# Altium schematic sheet Experiment 4 0.0.0.SchDoc
size A4; Organization: Altium Limited; Address1: L3, 12a Rodborough Rd; Address2: Frenchs Forest; Address3: NSW; Address4: Australia 2086; DocumentNumber: 4; SheetNumber: 4; SheetTotal: 5
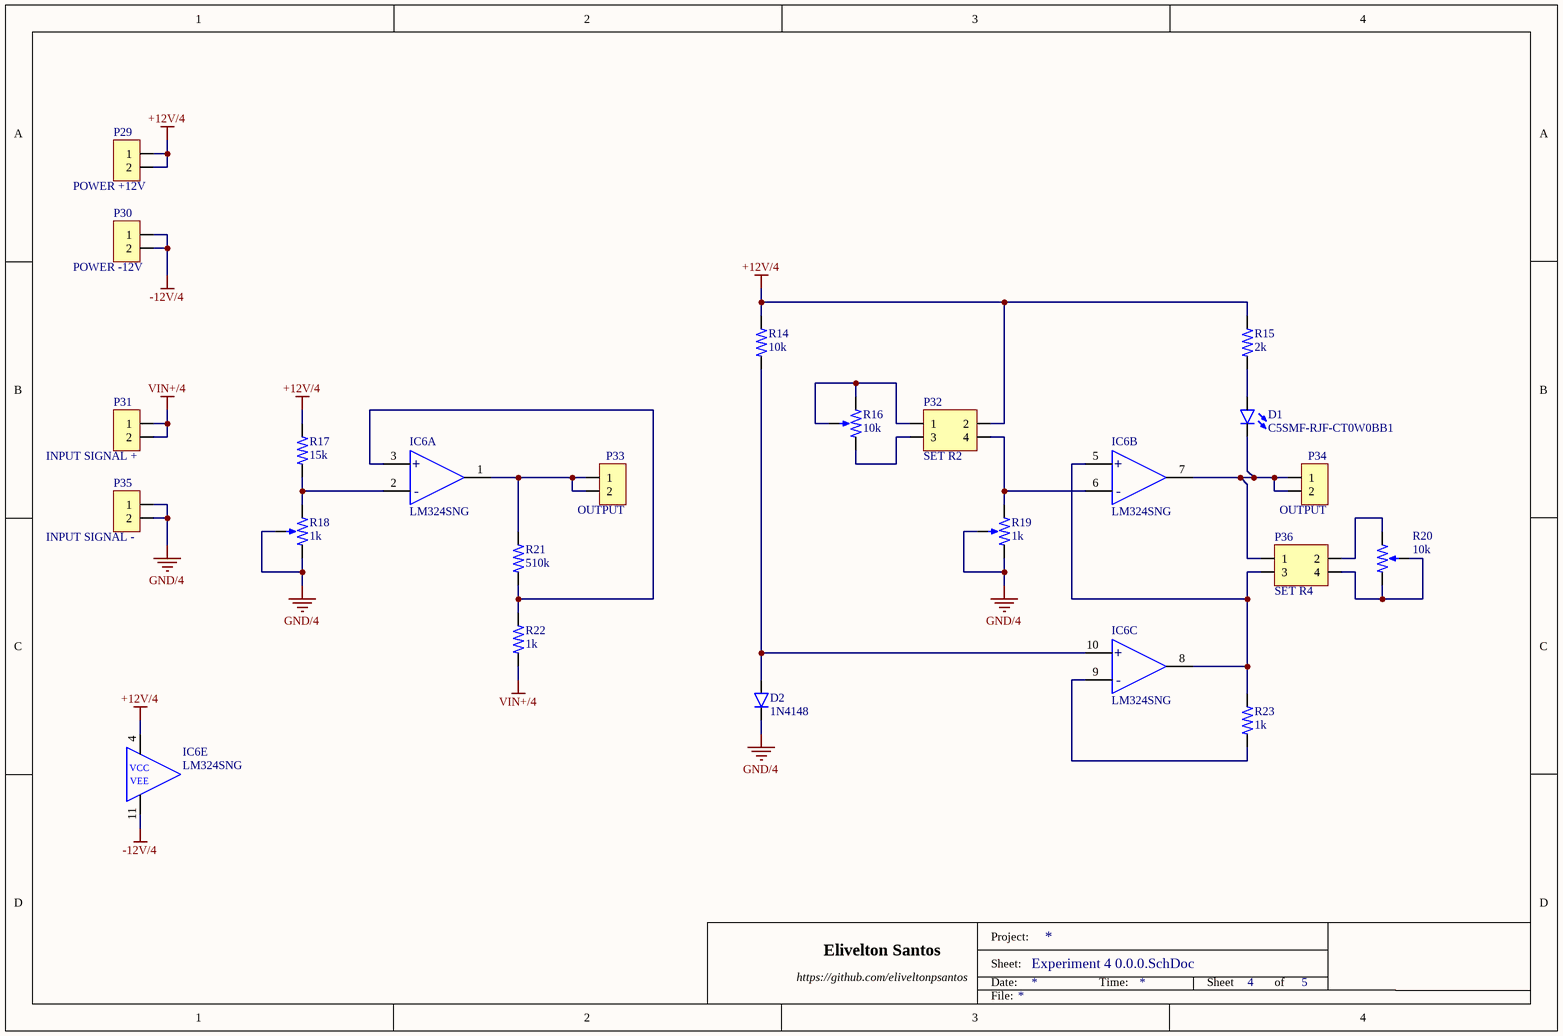
[diagram p0: Experiment 4 0.0.0.SchDoc]

## Parts
D1  C5SMF-RJF-CT0W0BB1  [LED-5MM]
D2  1N4148  [DO35-10]
IC6  LM324SNG  [DIP-14]  (parts A,B,C,E of 5)
P29  POWER +12V  [PINHD-1X02 ONCE]
P30  POWER -12V  [PINHD-1X02 ONCE]
P31  INPUT SIGNAL +  [PINHD-1X02 ONCE]
P32  SET R2  [PINHD-2X02]
P33  OUTPUT  [PINHD-1X02 ONCE]
P34  OUTPUT  [PINHD-1X02 ONCE]
P35  INPUT SIGNAL -  [PINHD-1X02 ONCE]
P36  SET R4  [PINHD-2X02]
R14  10k  [R Axial 0.25]
R15  2k  [R Axial 0.25]
R16  10k  [PV36W]
R17  15k  [R Axial 0.25]
R18  1k  [PV36W]
R19  1k  [PV36W]
R20  10k  [PV36W]
R21  510k  [R Axial 0.25]
R22  1k  [R Axial 0.25]
R23  1k  [R Axial 0.25]

## Nets
+12V/4: IC6.4(VCC) P29.1 P29.2 P32.2 R14.2 R15.2 R17.2
-12V/4: IC6.11(VEE) P30.1 P30.2
GND/4: D2.C(Cathode) P35.1 P35.2 R18.2 R18.3 R19.2 R19.3
VIN+/4: P31.1 P31.2 R22.1
NetD1_1: D1.1(Anode) R15.1
NetD1_2: D1.2(Cathode) IC6.7(OUTPUT_2) P34.1 P34.2 P36.1
NetD2_A: D2.A(Anode) IC6.10(INPUT_+_3) R14.1
NetIC6_1: IC6.1(OUTPUT_1) P33.1 P33.2 R21.2
NetIC6_2: IC6.2(INPUT_-_1) R17.1 R18.1
NetIC6_3: IC6.3(INPUT_+_1) R21.1 R22.2
NetIC6_5: IC6.5(INPUT_+_2) IC6.8(OUTPUT_3) P36.3 R23.2
NetIC6_6: IC6.6(INPUT_-_2) P32.4 R19.1
NetIC6_9: IC6.9(INPUT_-_3) R23.1
NetP32_1: P32.1 R16.1 R16.2
NetP32_3: P32.3 R16.3
NetP36_2: P36.2 R20.3
NetP36_4: P36.4 R20.1 R20.2

## Notes on the sheet
- Elivelton Santos
- https://github.com/eliveltonpsantos
- Project:
- Sheet:
- Date:
- Time:
- Sheet
- of
- File:
- (in symbol LM324SNG, part A) +; -
- (in symbol LM324SNG, part B) +; -
- (in symbol LM324SNG, part C) +; -

## Library data of the parts
D1 = C5SMF-RJF-CT0W0BB1: LED RED CLEAR 5MM OVAL T/H; Manufacturer: Cree Inc.; Category: Optoelectronics; Manufacturer Part Number: C5SMF-RJF-CT0W0BB1; Package / Case: 5mm Oval; Color: Red; Supplier 1: Digi-Key; Supplier Part Number 1: C5SMF-RJF-CT0W0BB1-ND
D2 = 1N4148: DIODE GEN PURP 100V 200MA DO35; Manufacturer: Fairchild Semiconductor; Category: Diodes; Manufacturer Part Number: 1N4148; Package / Case: DO-35; Reverse Voltage: 100V; Forward Current: 200mA; Supplier 1: Digi-Key; Supplier Part Number 1: 1N4148FS-ND
IC6 = LM324SNG: IC OP AMP 4CH 14DIP; Manufacturer: ON Semiconductor; Category: ICs; Manufacturer Part Number: LM324SNG; Package / Case: 14-PDIP; Supplier 1: Digi-Key; Supplier Part Number 1: LM324SNGOS-ND
P29-P31 P33-P35 = PIN HEADER 1X02 ONCE: CONN HEADER 2POS .100" STR TIN; Manufacturer: Molex, LLC; Manufacturer Part Number: 0901200122; Category: Connectors; Supplier 1: Digi-Key; Supplier Part Number 1: WM8072-ND
P32 P36 = PIN HEADER 2X02: CONN HEADER 4POS .100" STR TIN; Manufacturer: Molex, LLC; Manufacturer Part Number: 0901310122; Category: Connectors; Supplier 1: Digi-Key; Supplier Part Number 1: WM8120-ND
R14 = CFR-25JB-52-10K: RES 10K OHM 1/4W 5% AXIAL; Manufacturer: Yageo; Power (Watts): 0.25W, 1/4W; Category: Resistors; Manufacturer Part Number: CFR-25JB-52-10K; Package / Case: Axial; Resistance (Ohms): 10k; Tolerance: ±5%; Supplier 1: Digi-Key; Supplier Part Number 1: 10KQBK-ND
R15 = CFR-25JB-52-2K: RES 2K OHM 1/4W 5% AXIAL; Manufacturer: Yageo; Power (Watts): 0.25W, 1/4W; Category: Resistors; Manufacturer Part Number: CFR-25JB-52-2K; Package / Case: Axial; Resistance (Ohms): 2k; Tolerance: ±5%; Supplier 1: Digi-Key; Supplier Part Number 1: 2.0KQBK-ND
R16 R20 = PV36W103C01B00: TRIMMER 10K OHM 0.5W TH; Manufacturer: Bourns Inc.; Power (Watts): 0.5W, 1/2W; Tolerance: ±10%; Number of Turns: 25; Adjustment Type: Top Adjustment; Category: Resistors; Manufacturer Part Number: PV36W103C01B00; Resistance (Ohms): 10k; Supplier 1: Digi-Key; Supplier Part Number 1: 490-2875-ND
R17 = CFR-25JB-52-15K: RES 15K OHM 1/4W 5% AXIAL; Manufacturer: Yageo; Power (Watts): 0.25W, 1/4W; Category: Resistors; Manufacturer Part Number: CFR-25JB-52-15K; Package / Case: Axial; Resistance (Ohms): 15k; Tolerance: ±5%; Supplier 1: Digi-Key; Supplier Part Number 1: 15KQBK-ND
R18 R19 = PV36W102C01B00: TRIMMER 1K OHM 0.5W TH; Manufacturer: Bourns Inc.; Power (Watts): 0.5W, 1/2W; Tolerance: ±10%; Number of Turns: 25; Adjustment Type: Top Adjustment; Category: Resistors; Manufacturer Part Number: PV36W102C01B00; Resistance (Ohms): 1k; Supplier 1: Digi-Key; Supplier Part Number 1: 490-2874-ND
R21 = CFR-25JB-52-510K: RES 510K OHM 1/4W 5% AXIAL; Manufacturer: Yageo; Power (Watts): 0.25W, 1/4W; Category: Resistors; Manufacturer Part Number: CFR-25JB-52-510K; Package / Case: Axial; Resistance (Ohms): 510k; Tolerance: ±5%; Supplier 1: Digi-Key; Supplier Part Number 1: 510KQBK-ND
R22 R23 = CFR-25JB-52-1K: RES 1K OHM 1/4W 5% AXIAL; Manufacturer: Yageo; Power (Watts): 0.25W, 1/4W; Category: Resistors; Manufacturer Part Number: CFR-25JB-52-1K; Package / Case: Axial; Resistance (Ohms): 1k; Tolerance: ±5%; Supplier 1: Digi-Key; Supplier Part Number 1: 1.0KQBK-ND